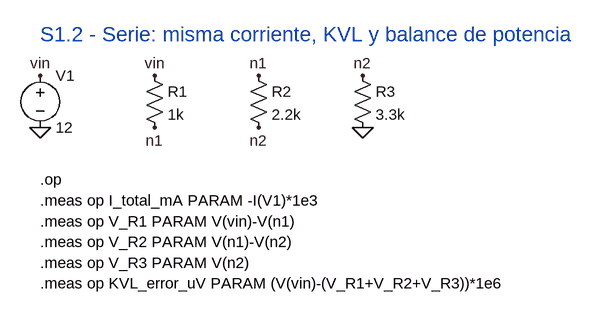
[diagram p0: schematic semana1_02_kvl_serie.asc]
semana1_02_kvl_serie.asc, the LTspice schematic file:
Version 4
SHEET 1 880 680
SYMBOL voltage 48 96 R0
SYMATTR InstName V1
SYMATTR Value 12
SYMBOL res 208 96 R0
SYMATTR InstName R1
SYMATTR Value 1k
SYMBOL res 368 96 R0
SYMATTR InstName R2
SYMATTR Value 2.2k
SYMBOL res 528 96 R0
SYMATTR InstName R3
SYMATTR Value 3.3k
FLAG 48 112 vin
FLAG 48 192 0
FLAG 224 112 vin
FLAG 224 192 n1
FLAG 384 112 n1
FLAG 384 192 n2
FLAG 544 112 n2
FLAG 544 192 0
TEXT 48 272 Left 2 !.op
TEXT 48 304 Left 2 !.meas op I_total_mA PARAM -I(V1)*1e3
TEXT 48 336 Left 2 !.meas op V_R1 PARAM V(vin)-V(n1)
TEXT 48 368 Left 2 !.meas op V_R2 PARAM V(n1)-V(n2)
TEXT 48 400 Left 2 !.meas op V_R3 PARAM V(n2)
TEXT 48 432 Left 2 !.meas op KVL_error_uV PARAM (V(vin)-(V_R1+V_R2+V_R3))*1e6
TEXT 48 48 Left 3 ;S1.2 - Serie: misma corriente, KVL y balance de potencia

The netlist it stands for:
* semana1_02_kvl_serie.asc
V1 vin 0 12
R1 vin n1 1k
R2 n1 n2 2.2k
R3 n2 0 3.3k
.op
.meas op I_total_mA PARAM -I(V1)*1e3
.meas op V_R1 PARAM V(vin)-V(n1)
.meas op V_R2 PARAM V(n1)-V(n2)
.meas op V_R3 PARAM V(n2)
.meas op KVL_error_uV PARAM (V(vin)-(V_R1+V_R2+V_R3))*1e6
* S1.2 - Serie: misma corriente, KVL y balance de potencia
.backanno
.end